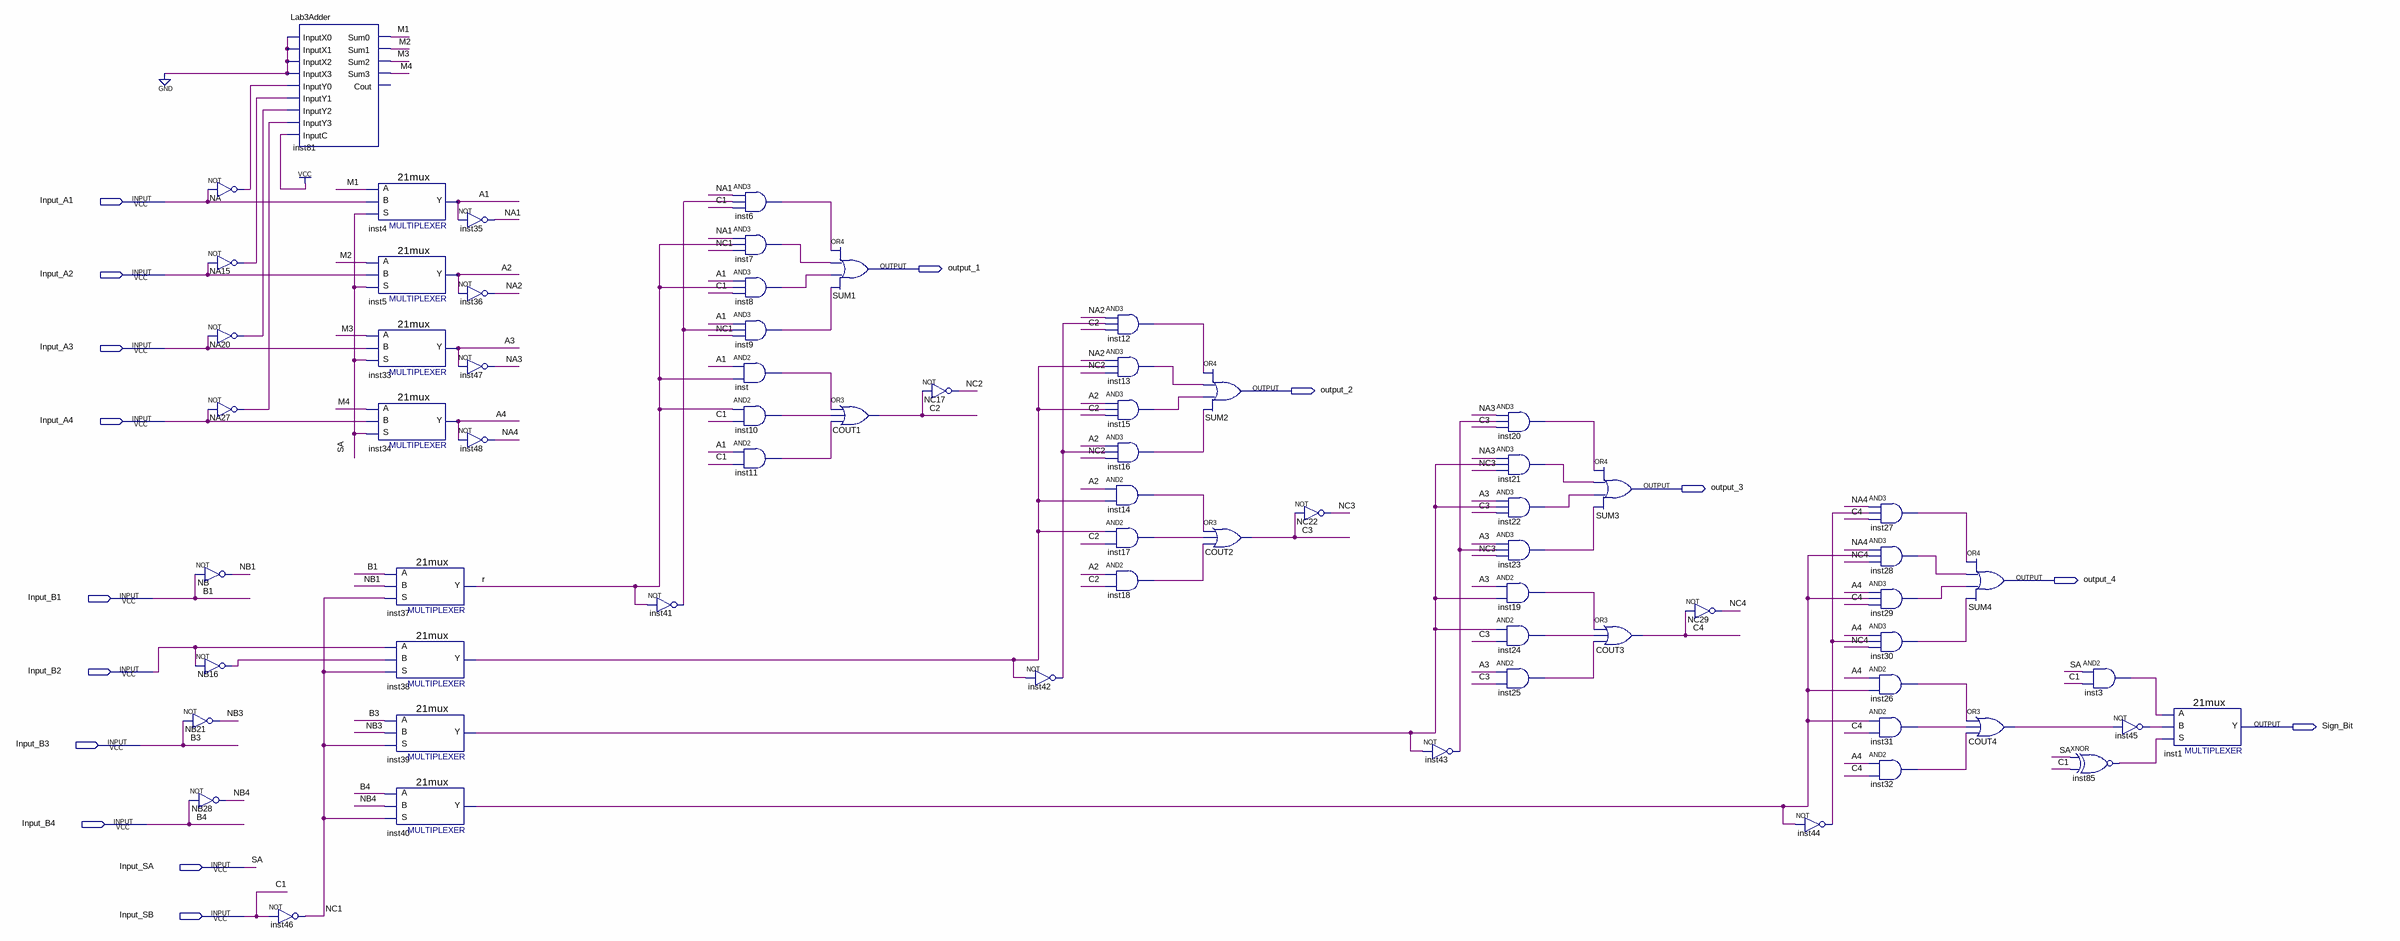
[diagram p0: schematic sheet]
// Quartus schematic AdderSubtracter.bdf as structural Verilog: 69 symbols, 15 pins
module AdderSubtracter (
  input  Input_A1,
  input  Input_A2,
  input  Input_A3,
  input  Input_A4,
  input  Input_B1,
  input  Input_B2,
  input  Input_B3,
  input  Input_B4,
  input  Input_SA,
  input  Input_SB,
  output output_1,
  output output_2,
  output output_3,
  output output_4,
  output Sign_Bit
);

  wire A1, A2, A3, A4, C2, C3, C4, COUT4_out, inst3_out, inst6_out, inst7_out, inst8_out, inst9_out,
       inst10_out, inst11_out, inst12_out, inst13_out, inst14_out, inst15_out, inst16_out, inst17_out,
       inst18_out, inst19_out, inst20_out, inst21_out, inst22_out, inst23_out, inst24_out, inst25_out,
       inst26_out, inst27_out, inst28_out, inst29_out, inst30_out, inst31_out, inst32_out, inst38_y,
       inst39_y, inst40_y, inst41_out, inst42_out, inst43_out, inst44_out, inst45_out, inst85_out, inst_out,
       M1, M2, M3, M4, NA1, NA2, NA3, NA4, NA15_out, NA20_out, NA27_out, NA_out, NB1, NB3, NB4, NB16_out,
       NC1, NC2, NC3, NC4, r;

  not NA (NA_out, Input_A1);
  not NA15 (NA15_out, Input_A2);
  not NA20 (NA20_out, Input_A3);
  not NA27 (NA27_out, Input_A4);
  not NB (NB1, Input_B1);
  not NB16 (NB16_out, Input_B2);
  not NB21 (NB3, Input_B3);
  not NB28 (NB4, Input_B4);
  not inst46 (NC1, Input_SB);
  Lab3Adder inst81 (
    .InputX0(1'b0), .InputX1(1'b0), .InputX2(1'b0), .InputX3(1'b0), .InputY0(NA_out), .InputY1(NA15_out),
    .InputY2(NA20_out), .InputY3(NA27_out), .InputC(1'b1), .Sum0(M1), .Sum1(M2), .Sum2(M3), .Sum3(M4));  // open: Cout
  \21mux  inst4 (.S(Input_SA), .B(Input_A1), .A(M1), .Y(A1));
  \21mux  inst5 (.S(Input_SA), .B(Input_A2), .A(M2), .Y(A2));
  \21mux  inst33 (.S(Input_SA), .B(Input_A3), .A(M3), .Y(A3));
  \21mux  inst34 (.S(Input_SA), .B(Input_A4), .A(M4), .Y(A4));
  \21mux  inst37 (.S(NC1), .B(NB1), .A(Input_B1), .Y(r));
  \21mux  inst38 (.S(NC1), .B(NB16_out), .A(Input_B2), .Y(inst38_y));
  \21mux  inst39 (.S(NC1), .B(NB3), .A(Input_B3), .Y(inst39_y));
  \21mux  inst40 (.S(NC1), .B(NB4), .A(Input_B4), .Y(inst40_y));
  not inst35 (NA1, A1);
  not inst36 (NA2, A2);
  not inst47 (NA3, A3);
  not inst48 (NA4, A4);
  not inst41 (inst41_out, r);
  and inst6 (inst6_out, NA1, inst41_out, Input_SB);
  and inst7 (inst7_out, NA1, r, NC1);
  and inst8 (inst8_out, A1, r, Input_SB);
  and inst9 (inst9_out, A1, inst41_out, NC1);
  and inst (inst_out, A1, r);
  and inst10 (inst10_out, r, Input_SB);
  and inst11 (inst11_out, A1, Input_SB);
  or SUM1 (output_1, inst6_out, inst7_out, inst8_out, inst9_out);
  or COUT1 (C2, inst_out, inst10_out, inst11_out);
  not NC17 (NC2, C2);
  not inst42 (inst42_out, inst38_y);
  and inst12 (inst12_out, NA2, inst42_out, C2);
  and inst13 (inst13_out, NA2, inst38_y, NC2);
  and inst15 (inst15_out, A2, inst38_y, C2);
  and inst16 (inst16_out, A2, inst42_out, NC2);
  and inst14 (inst14_out, A2, inst38_y);
  and inst17 (inst17_out, inst38_y, C2);
  and inst18 (inst18_out, A2, C2);
  or SUM2 (output_2, inst12_out, inst13_out, inst15_out, inst16_out);
  or COUT2 (C3, inst14_out, inst17_out, inst18_out);
  not NC22 (NC3, C3);
  not inst43 (inst43_out, inst39_y);
  and inst20 (inst20_out, NA3, inst43_out, C3);
  and inst21 (inst21_out, NA3, inst39_y, NC3);
  and inst22 (inst22_out, A3, inst39_y, C3);
  and inst23 (inst23_out, A3, inst43_out, NC3);
  and inst19 (inst19_out, A3, inst39_y);
  and inst24 (inst24_out, inst39_y, C3);
  and inst25 (inst25_out, A3, C3);
  or SUM3 (output_3, inst20_out, inst21_out, inst22_out, inst23_out);
  or COUT3 (C4, inst19_out, inst24_out, inst25_out);
  not NC29 (NC4, C4);
  not inst44 (inst44_out, inst40_y);
  and inst27 (inst27_out, NA4, inst44_out, C4);
  and inst28 (inst28_out, NA4, inst40_y, NC4);
  and inst29 (inst29_out, A4, inst40_y, C4);
  and inst30 (inst30_out, A4, inst44_out, NC4);
  and inst26 (inst26_out, A4, inst40_y);
  and inst31 (inst31_out, inst40_y, C4);
  and inst32 (inst32_out, A4, C4);
  or SUM4 (output_4, inst27_out, inst28_out, inst29_out, inst30_out);
  or COUT4 (COUT4_out, inst26_out, inst31_out, inst32_out);
  xnor inst85 (inst85_out, Input_SA, Input_SB);
  and inst3 (inst3_out, Input_SA, Input_SB);
  not inst45 (inst45_out, COUT4_out);
  \21mux  inst1 (.S(inst85_out), .B(inst45_out), .A(inst3_out), .Y(Sign_Bit));

  // Other names for the same wires on the sheet: B1 = Input_B1; B3 = Input_B3; B4 = Input_B4; C1 = Input_SB;
  //   SA = Input_SA
endmodule
